# EAGLE design v1.1 (EAGLE 9.1.2)
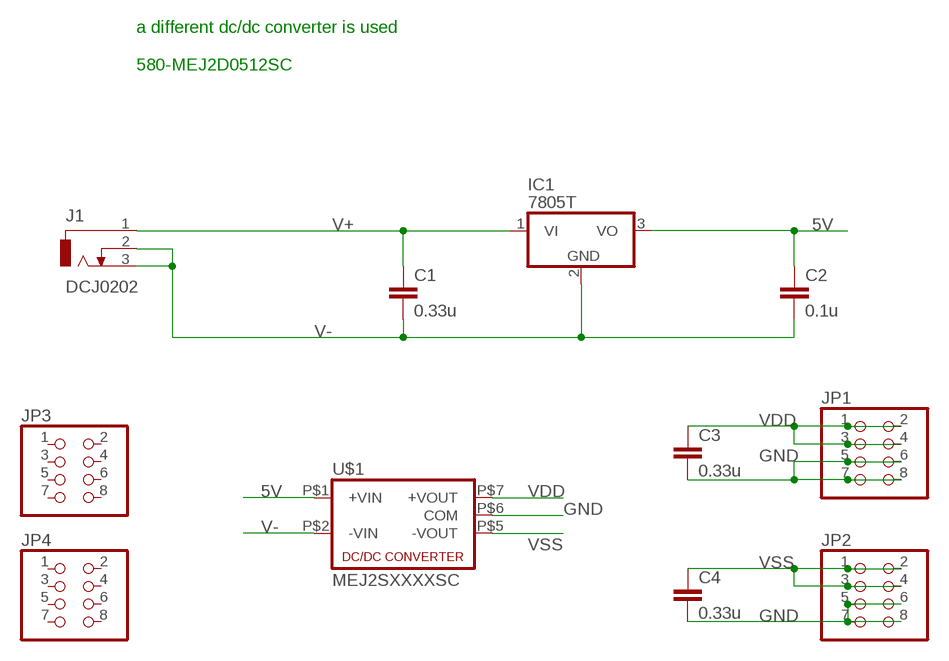
[diagram p0: schematic, sheet 1]

## Parts
C1  0.33u  C-EU050-045X075  [C050-045X075]
C2  0.1u  C-EU050-045X075  [C050-045X075]
C3  0.33u  C-EU050-045X075  [C050-045X075]
C4  0.33u  C-EU050-045X075  [C050-045X075]
IC1  7805T  [TO220H]
J1  DCJ0202  [DCJ0202]
JP1  PINHD-2X4  [2X04]
JP2  PINHD-2X4  [2X04]
JP3  PINHD-2X4  [2X04]
JP4  PINHD-2X4  [2X04]
U$1  MEJ2SXXXXSC  [NMA]

## Nets
5V: C2.1 IC1.3(VO) U$1.P$1(+VIN)
GND: C3.2 C4.2 JP1.5 JP1.6 JP1.7 JP1.8 JP2.5 JP2.6 JP2.7 JP2.8 U$1.P$6(COM)
V+: C1.1 IC1.1(VI) J1.1
V-: C1.2 C2.2 IC1.2(GND) J1.2 J1.3 U$1.P$2(-VIN)
VDD: C3.1 JP1.1 JP1.2 JP1.3 JP1.4 U$1.P$7(+VOUT)
VSS: C4.1 JP2.1 JP2.2 JP2.3 JP2.4 U$1.P$5(-VOUT)
Unconnected: JP3.1 JP3.2 JP3.3 JP3.4 JP3.5 JP3.6 JP3.7 JP3.8 JP4.1 JP4.2 JP4.3 JP4.4 JP4.5 JP4.6 JP4.7 JP4.8

## Notes on the sheet
- a different dc/dc converter is used
  
  580-MEJ2D0512SC

## Library data of the parts
C1-C4 = rcl:C-EU: CAPACITOR, European symbol; SPICEPREFIX: C
IC1 = linear:78*: Positive VOLTAGE REGULATOR Source: http://cache.national.com/ds/LM/LM78L05.pdf http://www.fairchildsemi.com/ds/LM/LM7805.pdf
J1 = con-jack:DCJ0202: DC POWER JACK Source: DCJ0202.pdf; OC_FARNELL: unknown; OC_NEWARK: unknown
JP1-JP4 = pinhead:PINHD-2X4: PIN HEADER
U$1 = uguz_cEGG:MEJ2SXXXXSC: MEJ2 Series Murata DC/DC Converter https://www.mouser.de/ProductDetail/Murata-Power-Solutions/MEJ2D0512SC?qs=%2Fha2pyFadugLeRHYxR%252Bys6Xit76p6s2nM82uQdUT4JI%3D

## Board
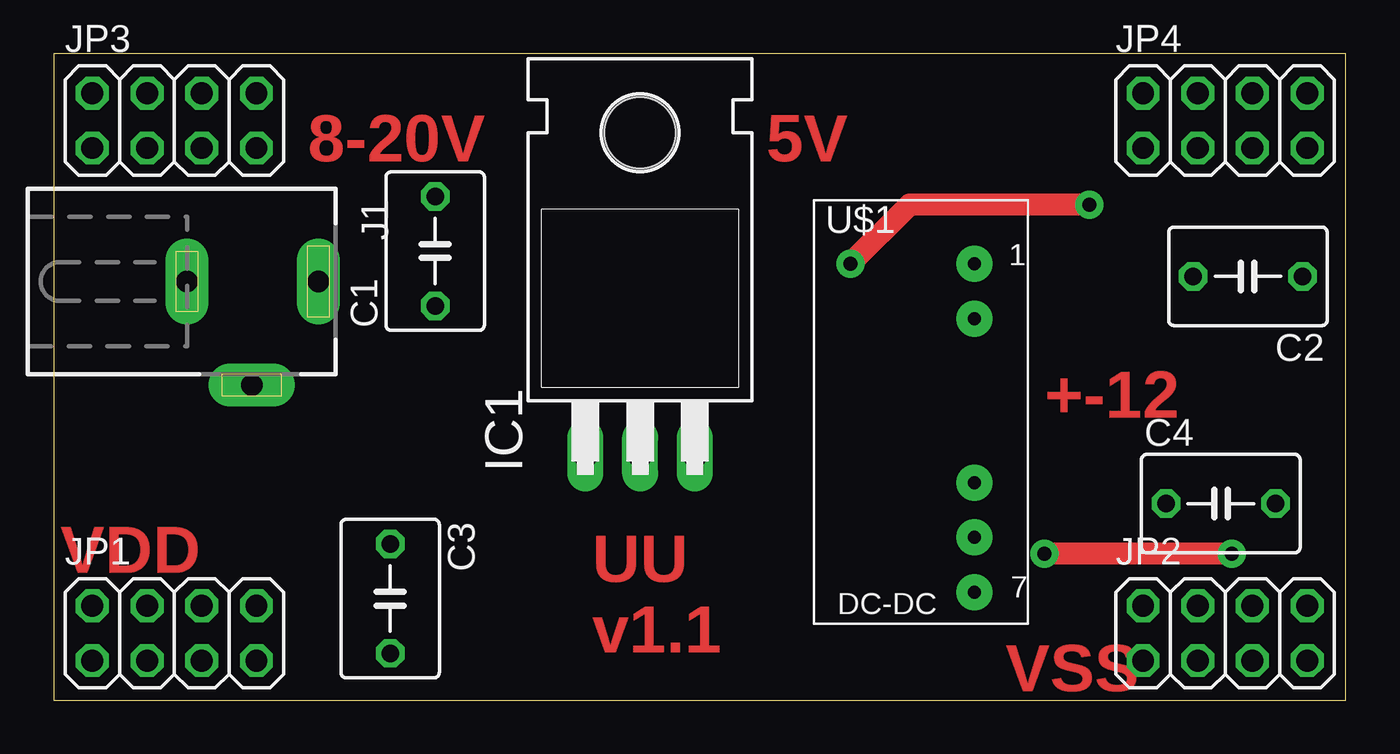
[diagram p1: board, top side]
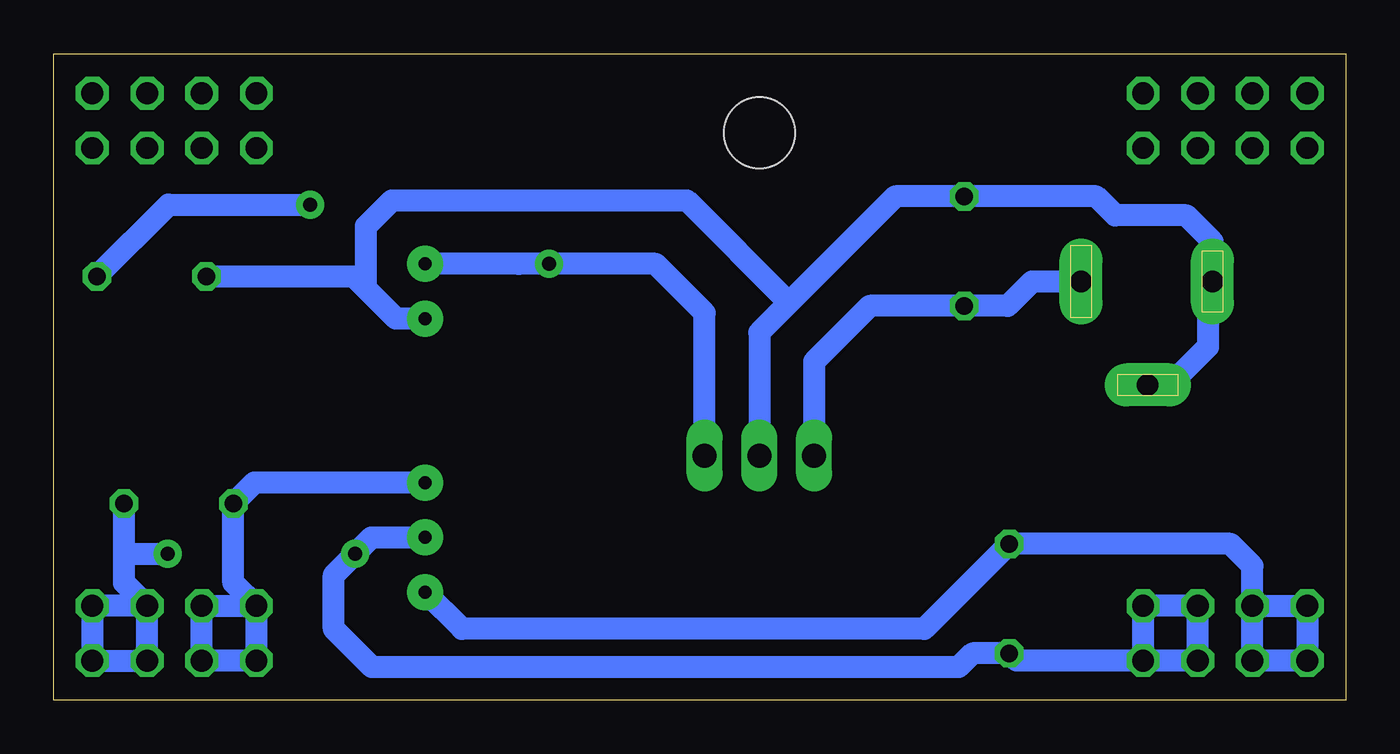
[diagram p2: board, bottom side, seen from below]

Size 60 x 30 mm. Coordinates in mm from the lower left corner, seen from the top.
Outline: 0,0 60,0 60,30 0,30 0,0
Copper layers (1*16): Top 0.035mm / dielectric 1.5mm / Bottom 0.035mm
Design rules "TM_medit_aetzen": minimum track width 10mil, minimum drill 8mil, track to track 10mil, track to pad 10mil, pad to pad 10mil, via to via 15mil, smd to smd 8mil, copper to edge 40mil, drill to drill 8mil, minimum pad ring 10mil, minimum via ring 8mil, stop-mask expansion 4mil, vias tented up to drill 0mil, thermal gap 10mil

### Footprints (pad centres in the part's own frame; a part is rotated, then mirrored left to right if it is on the bottom)
C050-045X075 = drill 0.813 octagon: 1 -2.54,0; 2 2.54,0
TO220H = drill 1.118 long: 1 -2.54,-10.16; 2 0,-10.16; 3 2.54,-10.16 | hole 3.302: 0,4.826
DCJ0202 = drill 1 pad 2 long: 1 0,3.1; 2 4.8,0; 3 0,-3
2X04 = drill 1.016 octagon: 1 -3.81,-1.27; 2 -3.81,1.27; 3 -1.27,-1.27; 4 -1.27,1.27; 5 1.27,-1.27; 6 1.27,1.27; 7 3.81,-1.27; 8 3.81,1.27
NMA = drill 0.6 pad 1.676: P$1 2.95,7.45; P$2 5.49,7.45; P$5 13.11,7.45; P$6 15.65,7.45; P$7 18.19,7.45

### Placement (x,y rotation side)
C1  17.71,20.84 90 top
C2  55.46,19.67 180 top
C3  15.62,4.71 270 top
C4  54.2,9.12 0 top
IC1  27.23,21.51 0 top
J1  9.19,19.43 270 top
JP1  5.6,3.1 0 top
JP2  54.4,3.1 0 top
JP3  5.6,26.9 0 top
JP4  54.4,26.9 0 top
U$1  35.3,23.2 270 top

### Tracks (layer width: path | path; a pad name or v marks a point on that pad's centre or on a via)
5V  (via drill 0.65 pad 1.3)
  Top 1.016: v48.1,23 39.75,23 v37,20.25
  Bottom 1.016: IC1.3 29.77,17.97 32.05,20.25 v37,20.25 38.4,20.25 U$1.P$1 | C2.1 54.67,23 v48.1,23
GND  (via drill 0.65 pad 1.3)
  Top 1.016: v54.7,6.8 v46,6.8
  Bottom 1.016: JP2.6 JP2.5 JP2.7 JP2.8 JP2.6 | JP2.6 56.74,5.44 56.74,6.8 | 56.74,6.8 C4.2 | JP1.7 15.28,1.83 C3.2 17.33,2.17 17.98,1.52 45.22,1.52 47,3.3 47,5.8 v46,6.8 45.25,7.55 U$1.P$6 | JP1.7 JP1.5 JP1.6 JP1.8 JP1.7 | 56.74,6.8 v54.7,6.8
V+
  Bottom 1.016: J1.1 14.57,19.43 15.7,18.3 C1.1 22.1,18.3 24.69,15.71 IC1.1
V-
  Bottom 1.016: J1.2 8.17,14.63 6.4,16.4 6.4,19.22 J1.3 6.19,21.29 7.4,22.5 10.7,22.5 11.58,23.38 C1.2 20.92,23.38 25.85,18.45 | IC1.2 27.23,17.07 25.85,18.45 | U$1.P$2 44.11,17.71 45.5,19.1 | 45.5,19.1 45.5,22 44.3,23.2 30.6,23.2 25.85,18.45 | C2.2 46.07,19.67 45.5,19.1
VDD
  Bottom 1.016: JP1.4 JP1.2 JP1.1 JP1.3 JP1.4 | JP1.4 4.33,6.23 5.35,7.25 C3.1 19.57,3.3 41.04,3.3 U$1.P$7
VSS
  Bottom 1.016: JP2.2 JP2.1 JP2.3 JP2.4 JP2.2 | U$1.P$5 50.69,10.09 C4.1 51.66,5.44 JP2.2

### Text on the board
Top: 8-20V | 5V | +-12 | VDD | UU / v1.1 | VSS